# EAGLE design Dashboard (EAGLE 9.4.2)

## Sheet 1 of 7
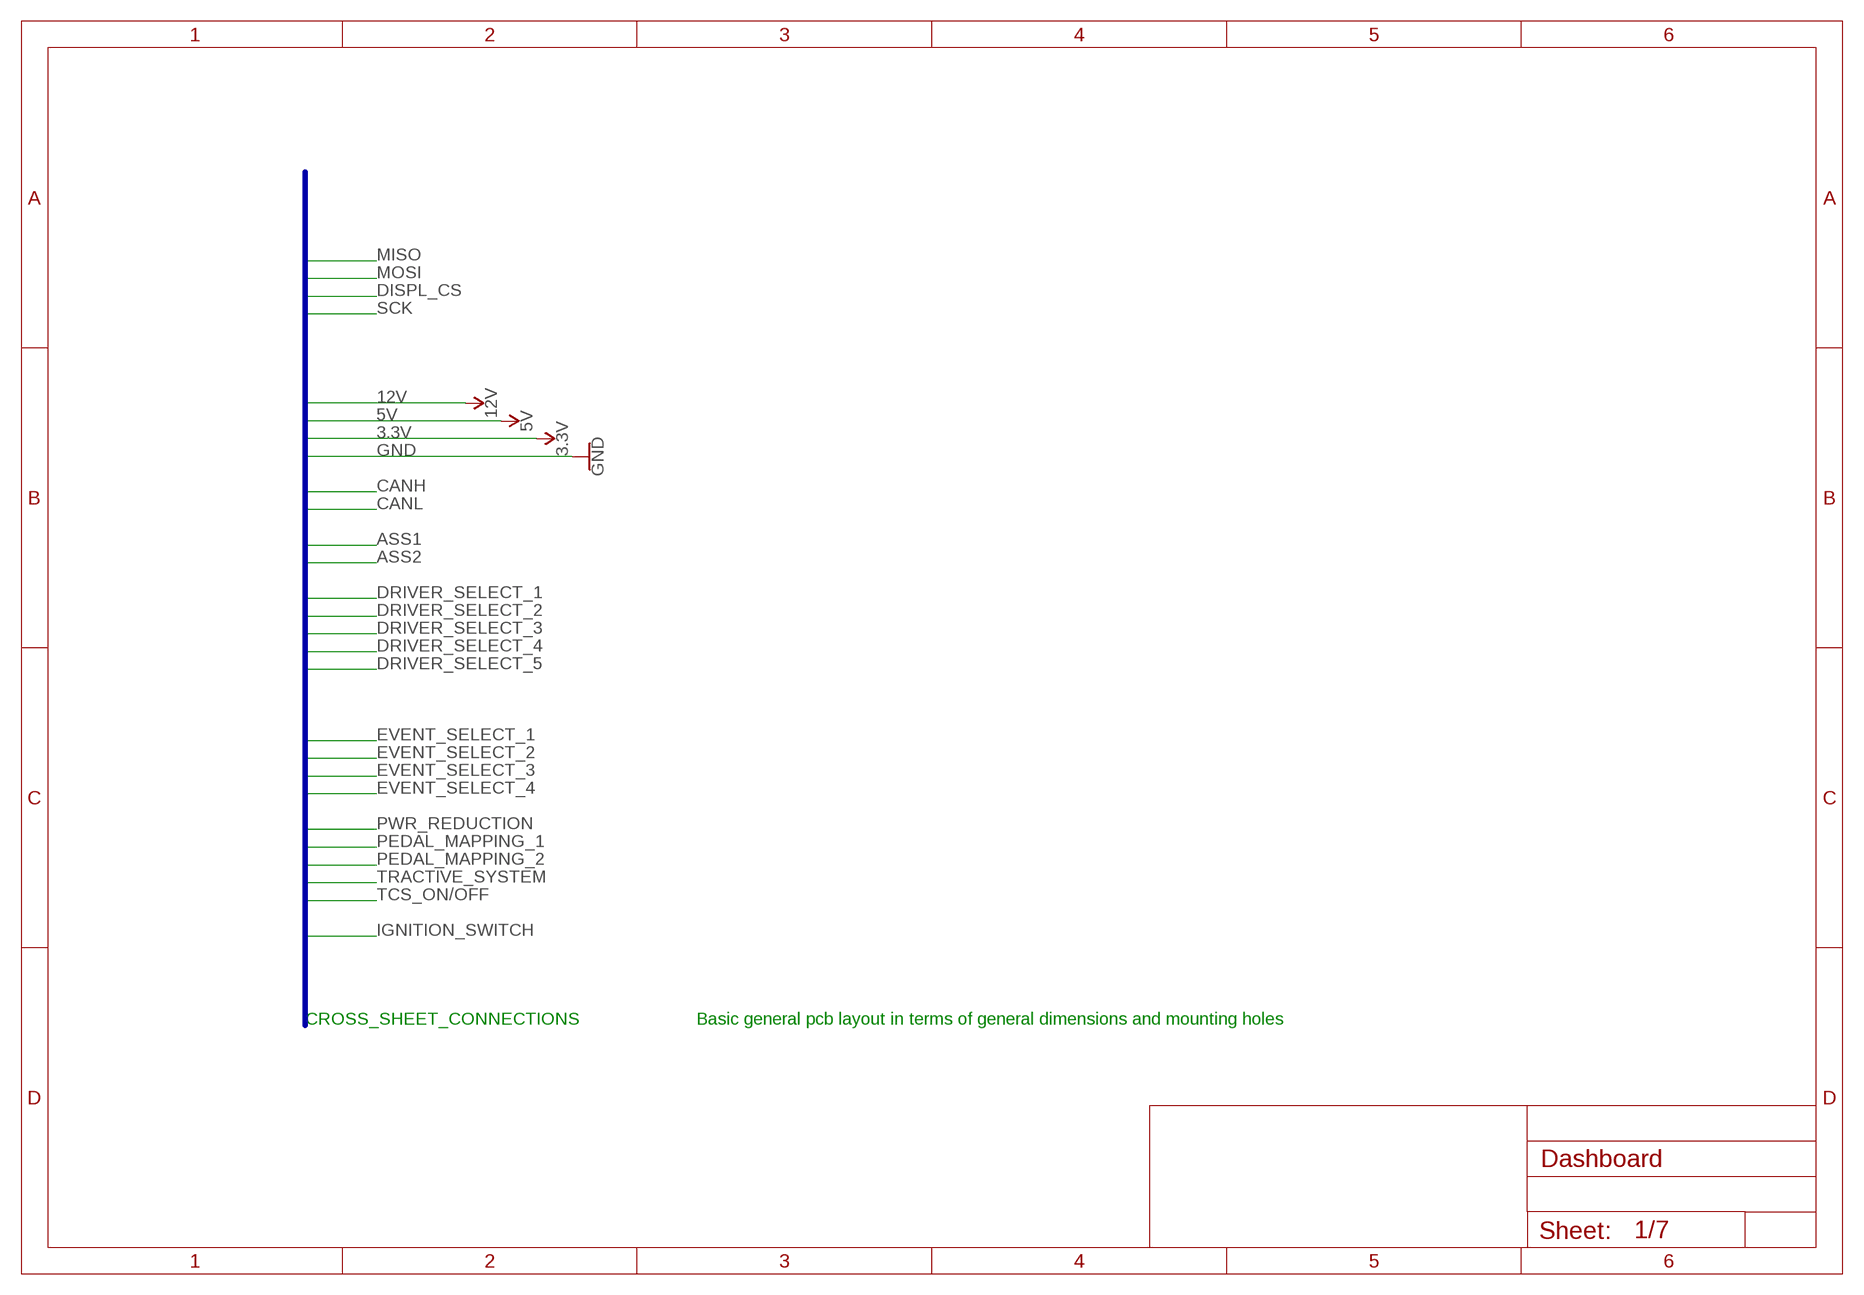
[diagram p0: schematic, sheet 1]

### Buses
3.3V,5V,12V,ASS1,ASS2,AUDIO_OUT,BRAKE_BIAS,CANH,CANL,DISPL_CS,DRIVER_SELECT,DRIVER_SELECT_1,DRIVER_SELECT_2,DRIVER_SELECT_3,DRIVER_SELECT_4,DRIVER_SELECT_5,EMERGENCY_STOP,EVENT_SELECT,EVENT_SELECT_1,EVENT_SELECT_2,EVENT_SELECT_3,EVENT_SELECT_4,GND,IGNITION_SWITCH,MISO,MOSI,MSIO,PEDAL_MAPPING,PEDAL_MAPPING_1,PEDAL_MAPPING_2,PWR_REDUCTION,SCK,TCS_ON/OFF,TSMS

### Notes on the sheet
- CROSS_SHEET_CONNECTIONS | Basic general pcb layout in terms of general dimensions and mounting holes

## Sheet 2 of 7: INPUTS
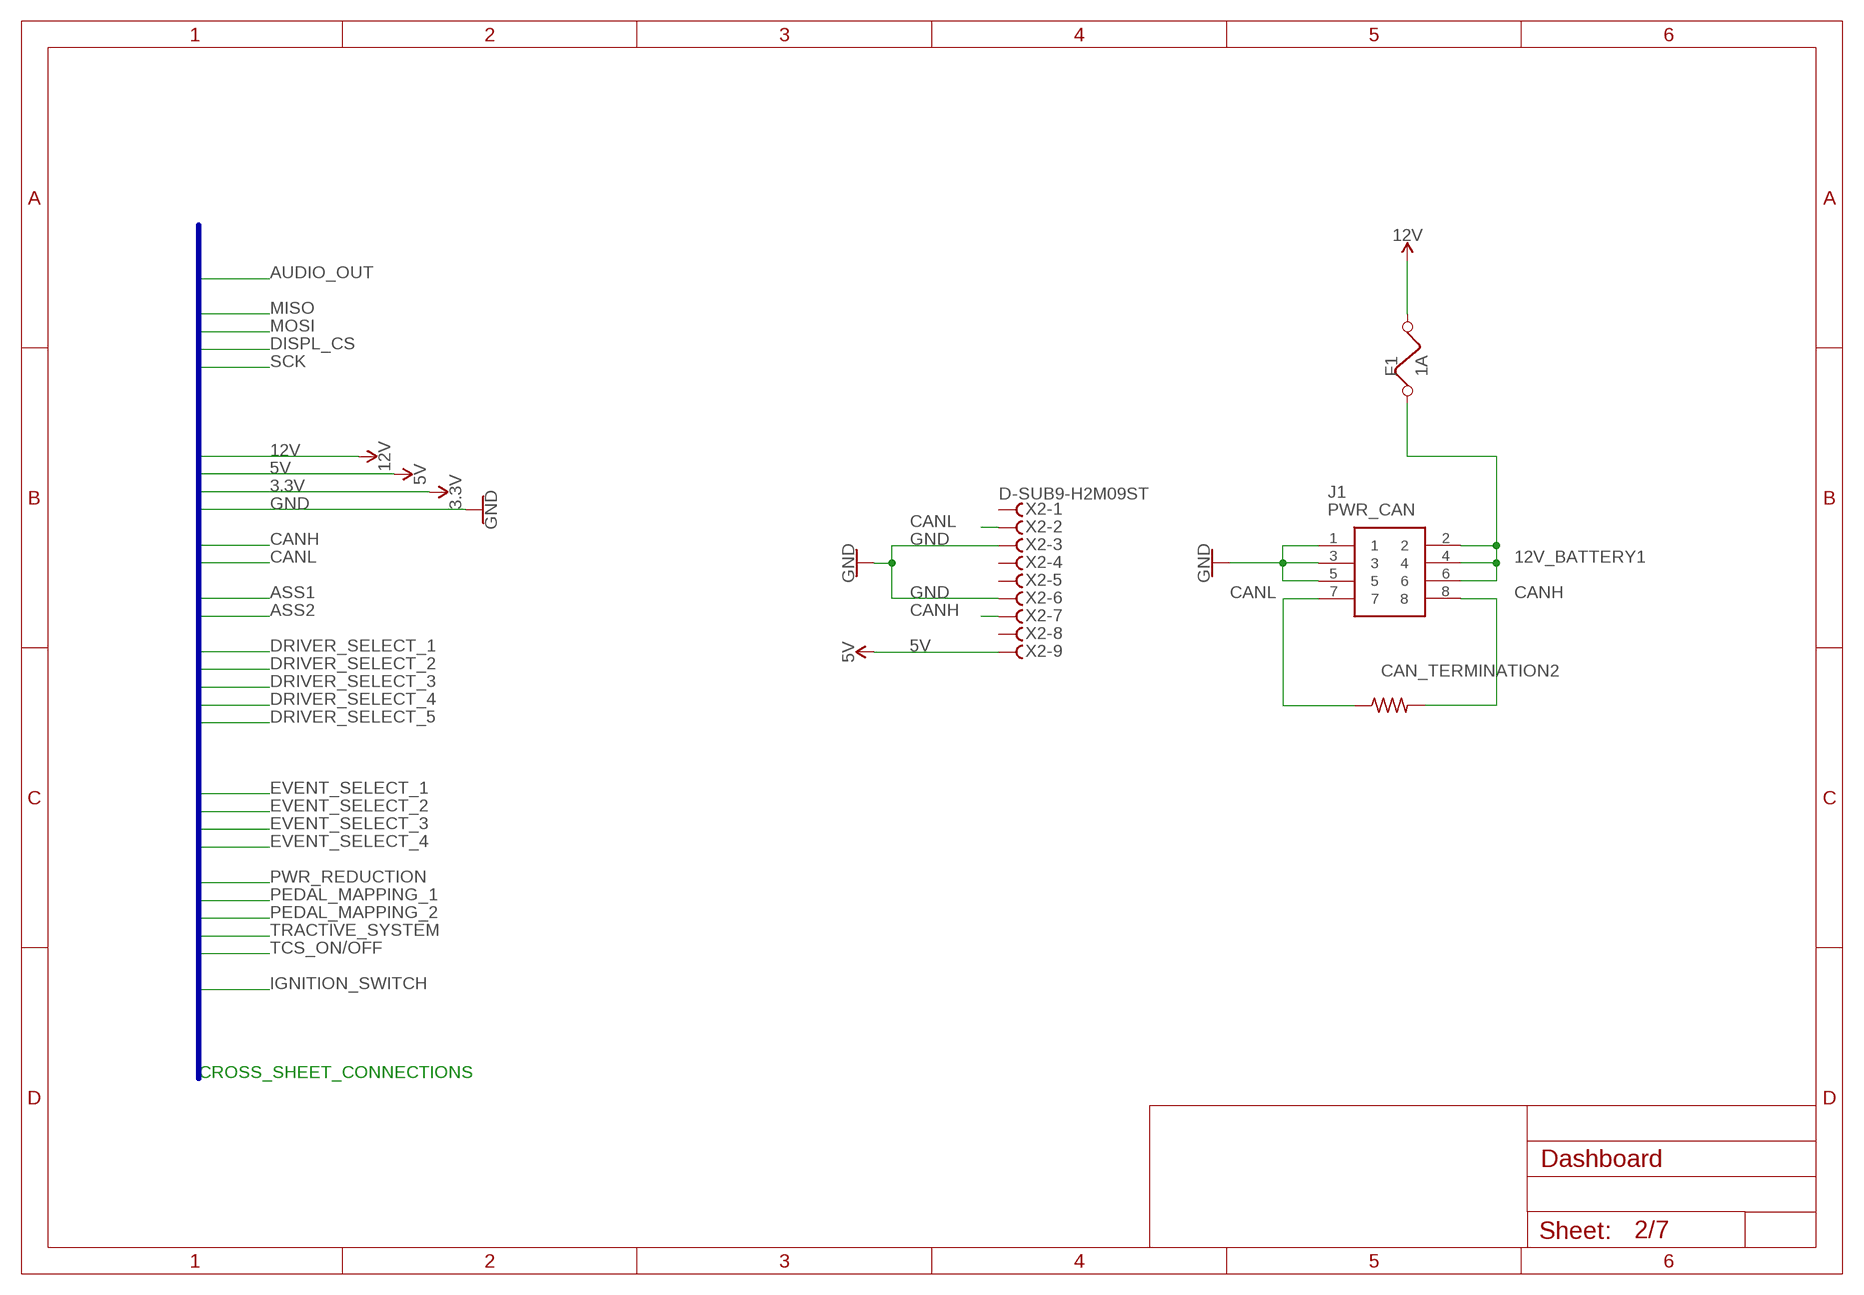
[diagram p1: schematic, sheet 2]

### Parts
CAN_TERMINATION2  120  R-US_R0805  [R0805]
F1  1A  FUSE  [FUSE]
J1  PWR_CAN  T821108A1S100CEU  [HDRV8W64P254_2X4_1778X895X915P]
X2  D-SUB9-H2M09ST  [H2M09ST]

### Nets
5V: X2.9 ; also sheet 1,3,4,5,6,7
12V: F1.2 ; also sheet 1,3,4,5,6,7
12V_BATTERY1: F1.1 J1.2 J1.4 J1.6
CANH: CAN_TERMINATION2.2 J1.8 X2.7 ; also sheet 1,3,4,5,6,7
CANL: CAN_TERMINATION2.1 J1.7 X2.2 ; also sheet 1,3,4,5,6,7
GND: J1.1 J1.3 J1.5 X2.3 X2.6 ; also sheet 1,3,4,5,6,7
Unconnected: X2.1 X2.4 X2.5 X2.8

### Buses
3.3V,5V,12V,ASS1,ASS2,BRAKE_BIAS,CANH,CANL,DISPL_CS,DRIVER_SELECT,DRIVER_SELECT_1,DRIVER_SELECT_2,DRIVER_SELECT_3,DRIVER_SELECT_4,DRIVER_SELECT_5,EMERGENCY_STOP,EVENT_SELECT,EVENT_SELECT_1,EVENT_SELECT_2,EVENT_SELECT_3,EVENT_SELECT_4,GND,IGNITION_SWITCH,MISO,MOSI,MSIO,PEDAL_MAPPING,PEDAL_MAPPING_1,PEDAL_MAPPING_2,PWR_REDUCTION,SCK,TCS_ON/OFF,TRACTIVE_SYSTEM,TSMS

### Notes on the sheet
- CROSS_SHEET_CONNECTIONS

## Sheet 3 of 7: POWER DELIVERY
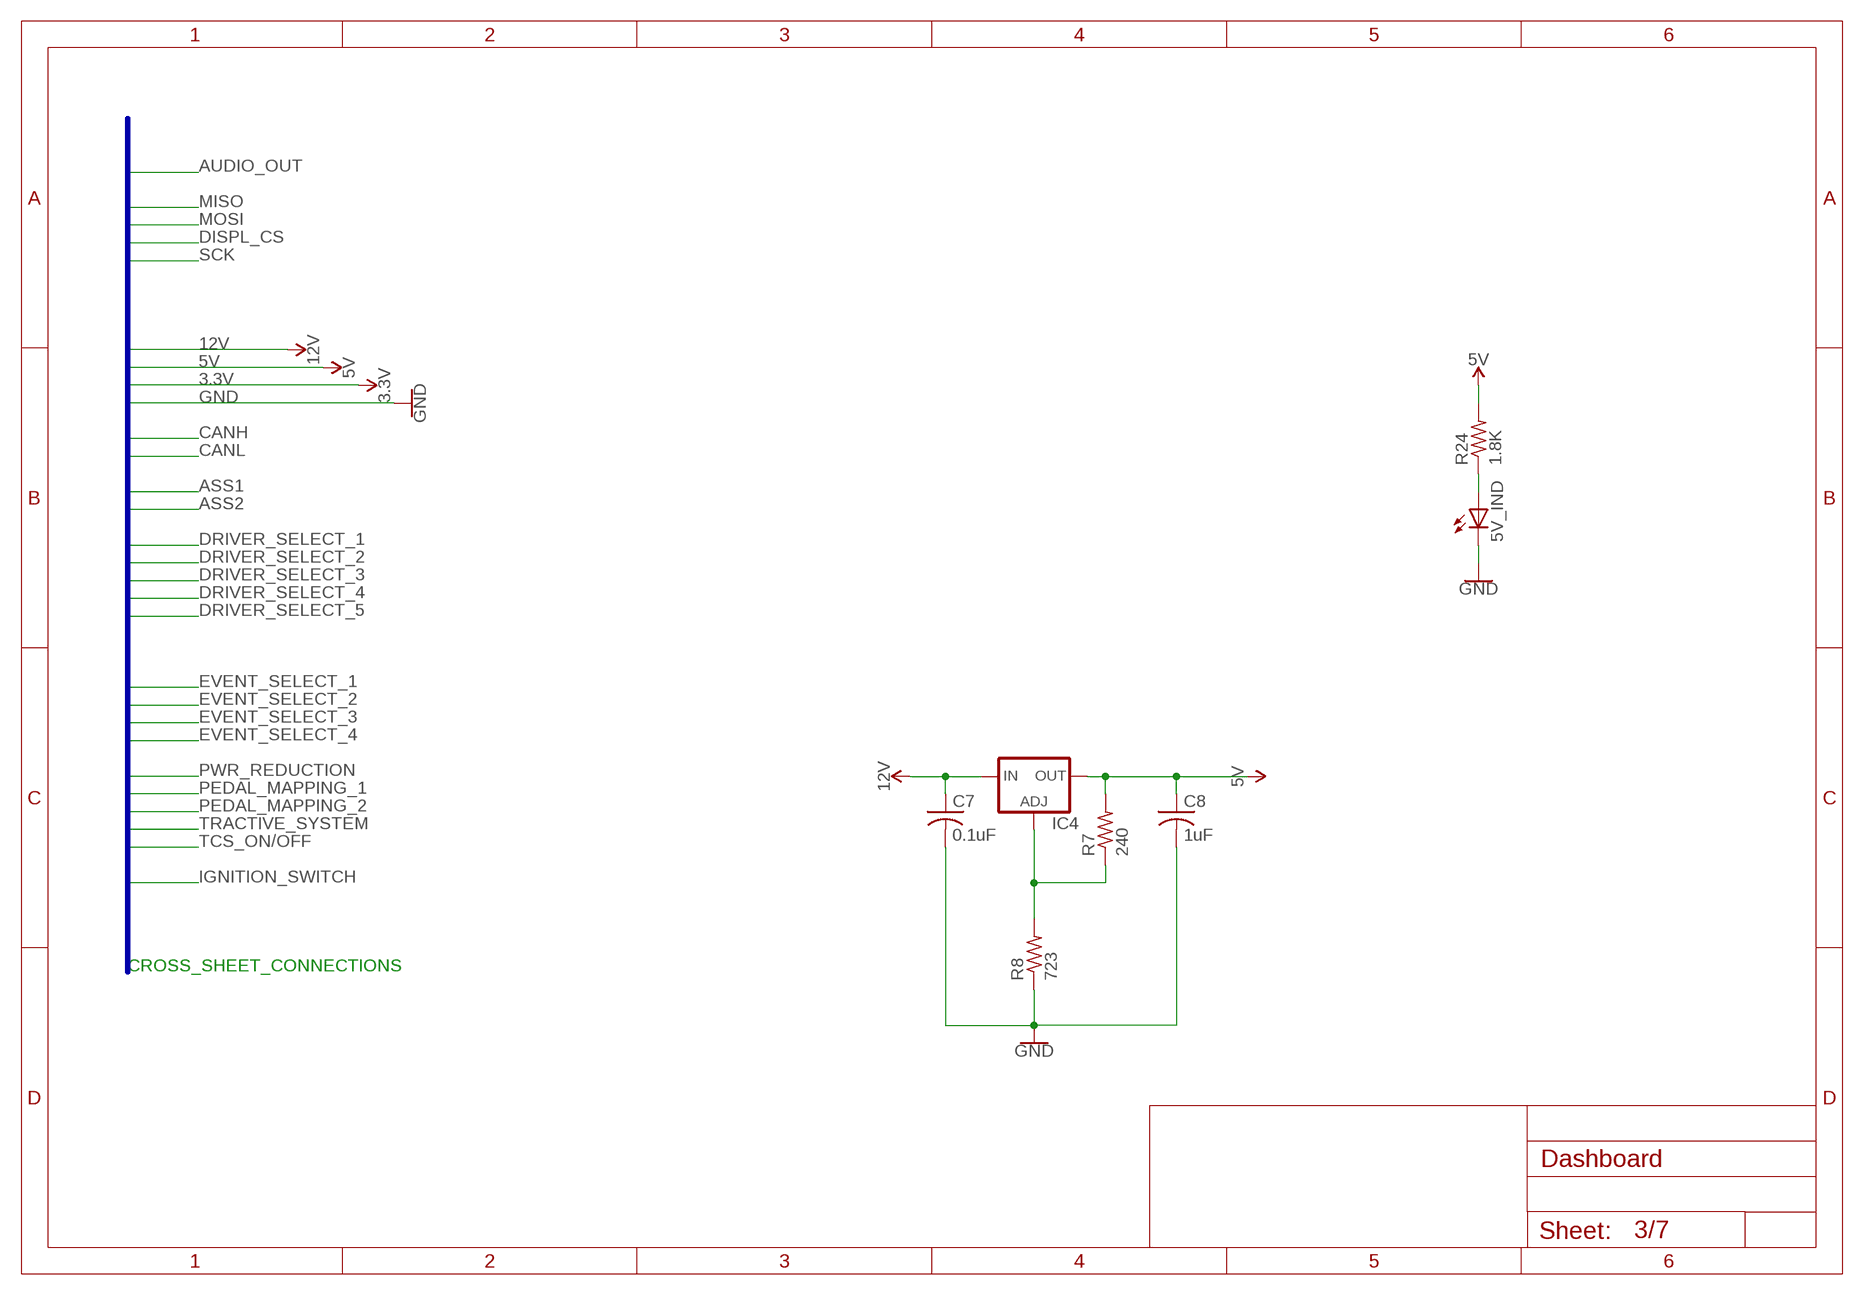
[diagram p2: schematic, sheet 3]

### Parts
5V_IND  LED3MM  [LED3MM]
C7  0.1uF  C-US050-025X075  [C050-025X075]
C8  1uF  C-US050-025X075  [C050-025X075]
IC4  LM317TS  [317TS]
R7  240  R-US_R0805  [R0805]
R8  723  R-US_R0805  [R0805]
R24  1.8K  R-US_R0805  [R0805]

### Nets
5V: C8.1 IC4.2(OUT) R7.2 R24.2 ; also sheet 1,2,4,5,6,7
12V: C7.1 IC4.3(IN) ; also sheet 1,2,4,5,6,7
GND: 5V_IND.K(C) C7.2 C8.2 R8.1 ; also sheet 1,2,4,5,6,7
N$1: 5V_IND.A R24.1
N$6: IC4.1(ADJ) R7.1 R8.2

### Buses
3.3V,5V,12V,ASS1,ASS2,BRAKE_BIAS,CANH,CANL,DISPL_CS,DRIVER_SELECT,DRIVER_SELECT_1,DRIVER_SELECT_2,DRIVER_SELECT_3,DRIVER_SELECT_4,DRIVER_SELECT_5,EMERGENCY_STOP,EVENT_SELECT,EVENT_SELECT_1,EVENT_SELECT_2,EVENT_SELECT_3,EVENT_SELECT_4,GND,IGNITION_SWITCH,MISO,MOSI,MSIO,PEDAL_MAPPING,PEDAL_MAPPING_1,PEDAL_MAPPING_2,PWR_REDUCTION,SCK,TCS_ON/OFF,TSMS

### Notes on the sheet
- CROSS_SHEET_CONNECTIONS

## Sheet 4 of 7: MICROCONTROLLER
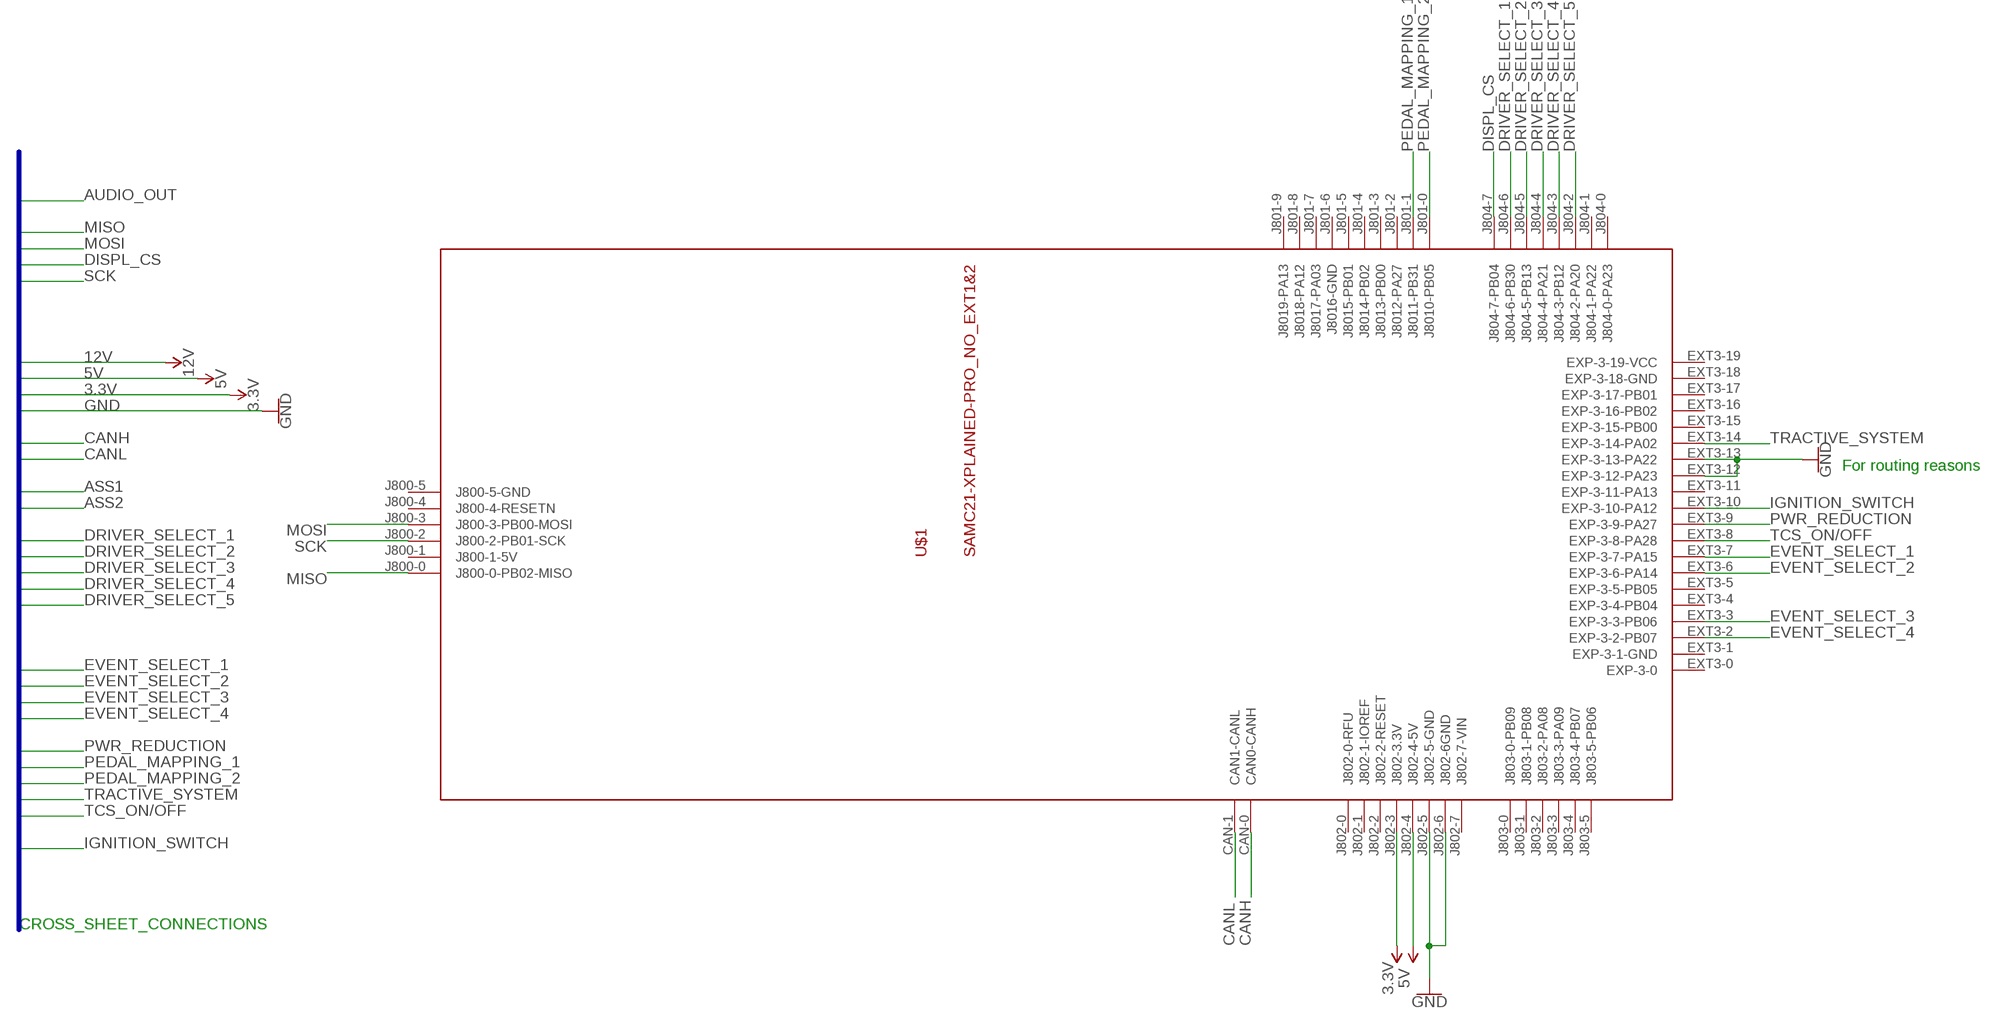
[diagram p3: schematic, sheet 4]

### Parts
U$1  SAMC21-XPLAINED-PRO_NO_EXT1&2  [SAMC21-XPLAINED-PRO_NO_EXT1&2]

### Nets
3.3V: U$1.J802-3(J802-3.3V) ; also sheet 1,2,3,5,6,7
5V: U$1.J802-4(J802-4-5V) ; also sheet 1,2,3,5,6,7
CANH: U$1.CAN-0(CAN0-CANH) ; also sheet 1,2,3,5,6,7
CANL: U$1.CAN-1(CAN1-CANL) ; also sheet 1,2,3,5,6,7
DISPL_CS: U$1.J804-7(J804-7-PB04) ; also sheet 1,2,3,5,6,7
DRIVER_SELECT_1: U$1.J804-6(J804-6-PB30) ; also sheet 1,2,3,5,6,7
DRIVER_SELECT_2: U$1.J804-5(J804-5-PB13) ; also sheet 1,2,3,5,6,7
DRIVER_SELECT_3: U$1.J804-4(J804-4-PA21) ; also sheet 1,2,3,5,6,7
DRIVER_SELECT_4: U$1.J804-3(J804-3-PB12) ; also sheet 1,2,3,5,6,7
DRIVER_SELECT_5: U$1.J804-2(J804-2-PA20) ; also sheet 1,2,3,5,6,7
EVENT_SELECT_1: U$1.EXT3-7(EXP-3-7-PA15) ; also sheet 1,2,3,5,6,7
EVENT_SELECT_2: U$1.EXT3-6(EXP-3-6-PA14) ; also sheet 1,2,3,5,6,7
EVENT_SELECT_3: U$1.EXT3-3(EXP-3-3-PB06) ; also sheet 1,2,3,5,6,7
EVENT_SELECT_4: U$1.EXT3-2(EXP-3-2-PB07) ; also sheet 1,2,3,5,6,7
GND: U$1.EXT3-12(EXP-3-12-PA23) U$1.EXT3-13(EXP-3-13-PA22) U$1.J802-5(J802-5-GND) U$1.J802-6(J802-6GND) ; also sheet 1,2,3,5,6,7
IGNITION_SWITCH: U$1.EXT3-10(EXP-3-10-PA12) ; also sheet 1,2,3,5,6,7
MISO: U$1.J800-0(J800-0-PB02-MISO) ; also sheet 1,2,3,5,6,7
MOSI: U$1.J800-3(J800-3-PB00-MOSI) ; also sheet 1,2,3,5,6,7
PEDAL_MAPPING_1: U$1.J801-1(J8011-PB31) ; also sheet 1,2,3,5,6,7
PEDAL_MAPPING_2: U$1.J801-0(J8010-PB05) ; also sheet 1,2,3,5,6,7
PWR_REDUCTION: U$1.EXT3-9(EXP-3-9-PA27) ; also sheet 1,2,3,5,6,7
SCK: U$1.J800-2(J800-2-PB01-SCK) ; also sheet 1,2,3,5,6,7
TCS_ON/OFF: U$1.EXT3-8(EXP-3-8-PA28) ; also sheet 1,2,3,5,6,7
TRACTIVE_SYSTEM: U$1.EXT3-14(EXP-3-14-PA02) ; also sheet 1,2,3,5,6,7
Unconnected: U$1.EXT3-0(EXP-3-0) U$1.EXT3-1(EXP-3-1-GND) U$1.EXT3-4(EXP-3-4-PB04) U$1.EXT3-5(EXP-3-5-PB05) U$1.EXT3-11(EXP-3-11-PA13) U$1.EXT3-15(EXP-3-15-PB00) U$1.EXT3-16(EXP-3-16-PB02) U$1.EXT3-17(EXP-3-17-PB01) U$1.EXT3-18(EXP-3-18-GND) U$1.EXT3-19(EXP-3-19-VCC) U$1.J800-1(J800-1-5V) U$1.J800-4(J800-4-RESETN) U$1.J800-5(J800-5-GND) U$1.J801-2(J8012-PA27) U$1.J801-3(J8013-PB00) U$1.J801-4(J8014-PB02) U$1.J801-5(J8015-PB01) U$1.J801-6(J8016-GND) U$1.J801-7(J8017-PA03) U$1.J801-8(J8018-PA12) U$1.J801-9(J8019-PA13) U$1.J802-0(J802-0-RFU) U$1.J802-1(J802-1-IOREF) U$1.J802-2(J802-2-RESET) U$1.J802-7(J802-7-VIN) U$1.J803-0(J803-0-PB09) U$1.J803-1(J803-1-PB08) U$1.J803-2(J803-2-PA08) U$1.J803-3(J803-3-PA09) U$1.J803-4(J803-4-PB07) U$1.J803-5(J803-5-PB06) U$1.J804-0(J804-0-PA23) U$1.J804-1(J804-1-PA22)

### Buses
3.3V,5V,12V,ASS1,ASS2,AUDIO_OUT,BRAKE_BIAS,CANH,CANL,DISPL_CS,DRIVER_SELECT,DRIVER_SELECT_1,DRIVER_SELECT_2,DRIVER_SELECT_3,DRIVER_SELECT_4,DRIVER_SELECT_5,EMERGENCY_STOP,EVENT_SELECT,EVENT_SELECT_1,EVENT_SELECT_2,EVENT_SELECT_3,EVENT_SELECT_4,GND,IGNITION_SWITCH,MISO,MOSI,MSIO,PEDAL_MAPPING,PEDAL_MAPPING_1,PEDAL_MAPPING_2,PWR_REDUCTION,SCK,TCS_ON/OFF,TRACTIVE_SYSTEM,TSMS

### Notes on the sheet
- For routing reasons
- CROSS_SHEET_CONNECTIONS

## Sheet 5 of 7: CAN OUTPUT
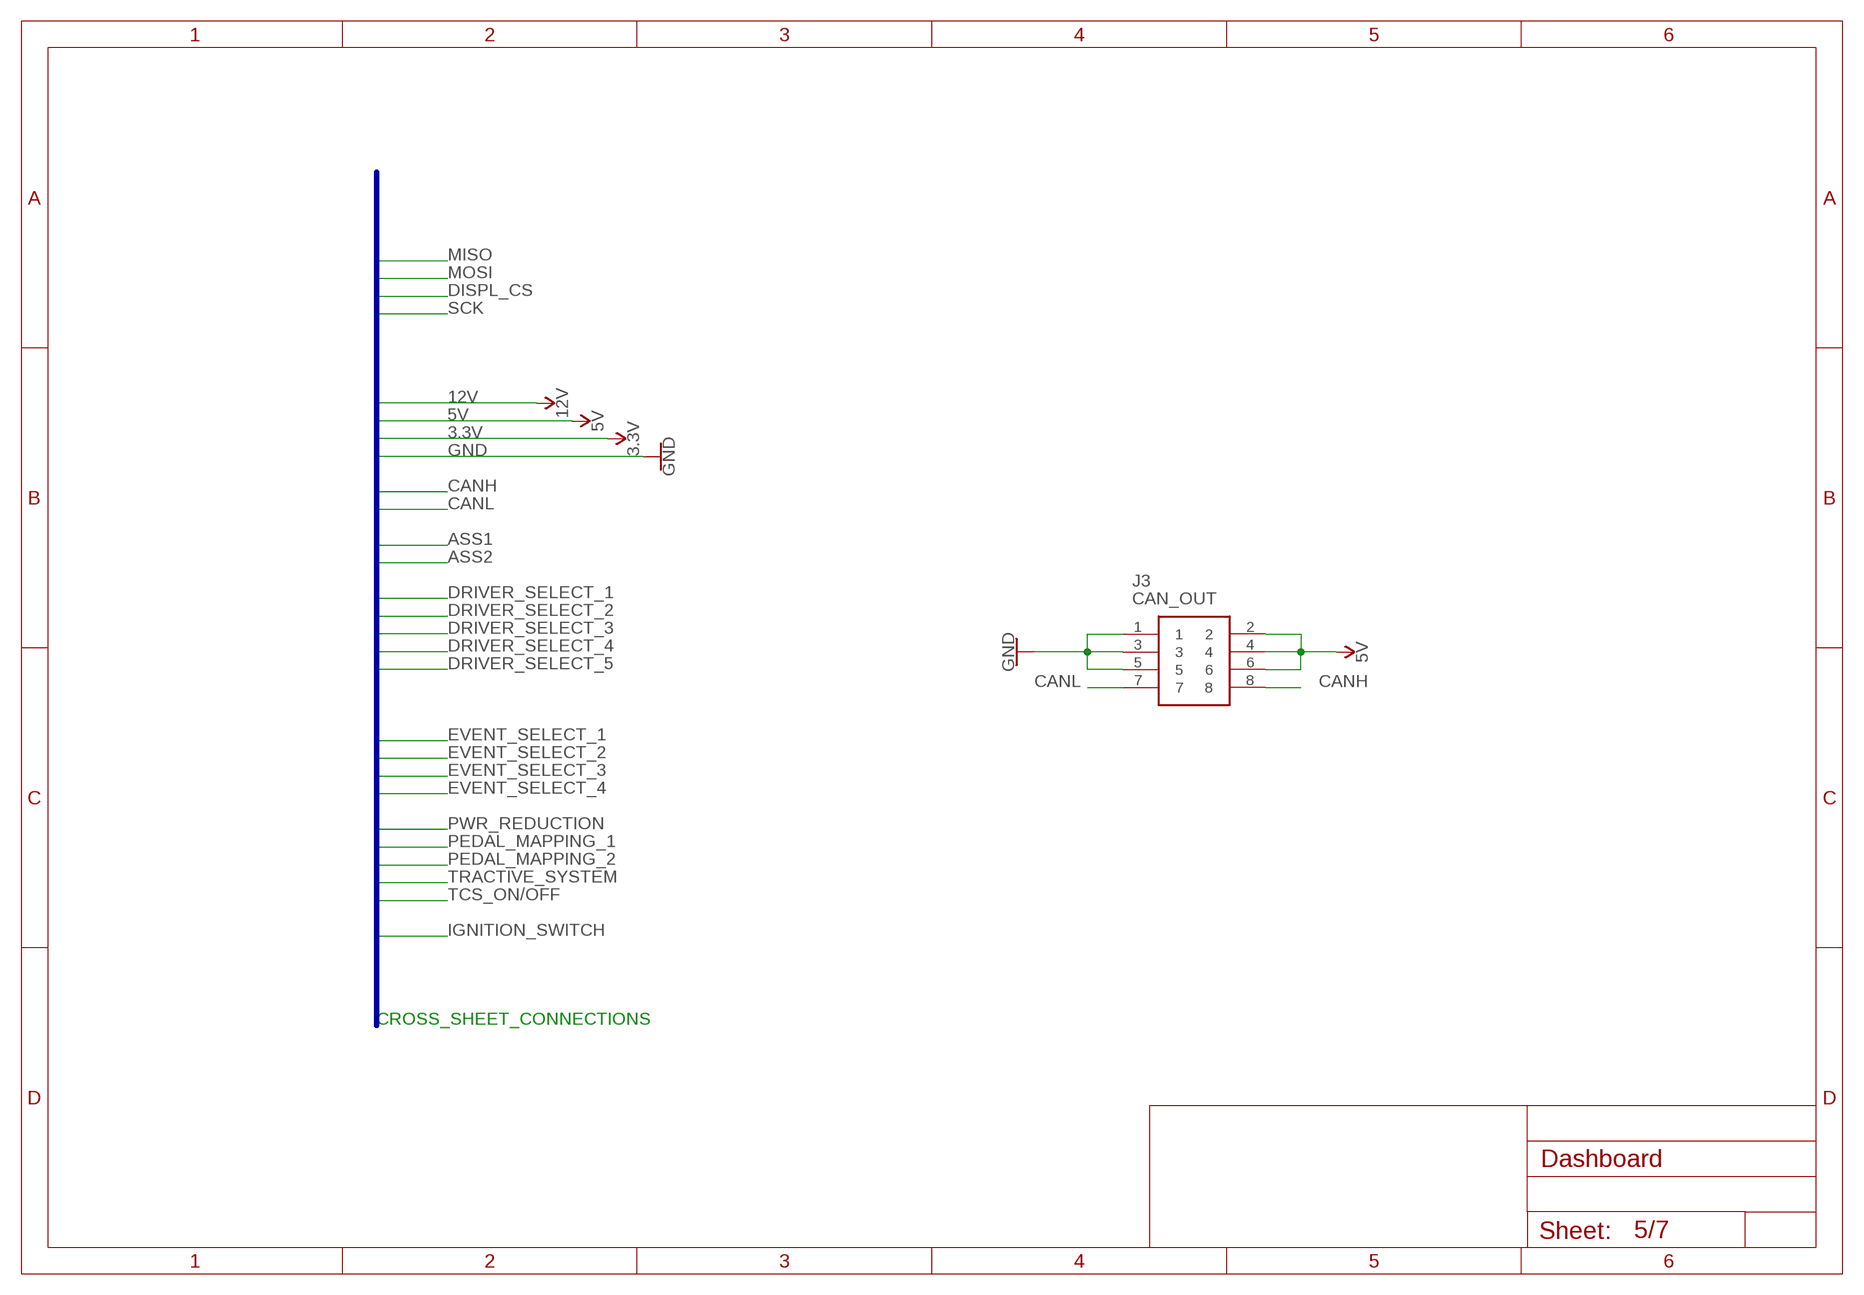
[diagram p4: schematic, sheet 5]

### Parts
J3  CAN_OUT  T821108A1S100CEU  [HDRV8W64P254_2X4_1778X895X915P]

### Nets
5V: J3.2 J3.4 J3.6 ; also sheet 1,2,3,4,6,7
CANH: J3.8 ; also sheet 1,2,3,4,6,7
CANL: J3.7 ; also sheet 1,2,3,4,6,7
GND: J3.1 J3.3 J3.5 ; also sheet 1,2,3,4,6,7

### Buses
3.3V,5V,12V,ASS1,ASS2,BRAKE_BIAS,CANH,CANL,DISPL_CS,DRIVER_SELECT,DRIVER_SELECT_1,DRIVER_SELECT_2,DRIVER_SELECT_3,DRIVER_SELECT_4,DRIVER_SELECT_5,EMERGENCY_STOP,EVENT_SELECT,EVENT_SELECT_1,EVENT_SELECT_2,EVENT_SELECT_3,EVENT_SELECT_4,GND,IGNITION_SWITCH,MISO,MOSI,MSIO,PEDAL_MAPPING,PEDAL_MAPPING_1,PEDAL_MAPPING_2,PWR_REDUCTION,SCK,TCS_ON/OFF,TSMS

### Notes on the sheet
- CROSS_SHEET_CONNECTIONS

## Sheet 6 of 7: DISPLAY MODULE
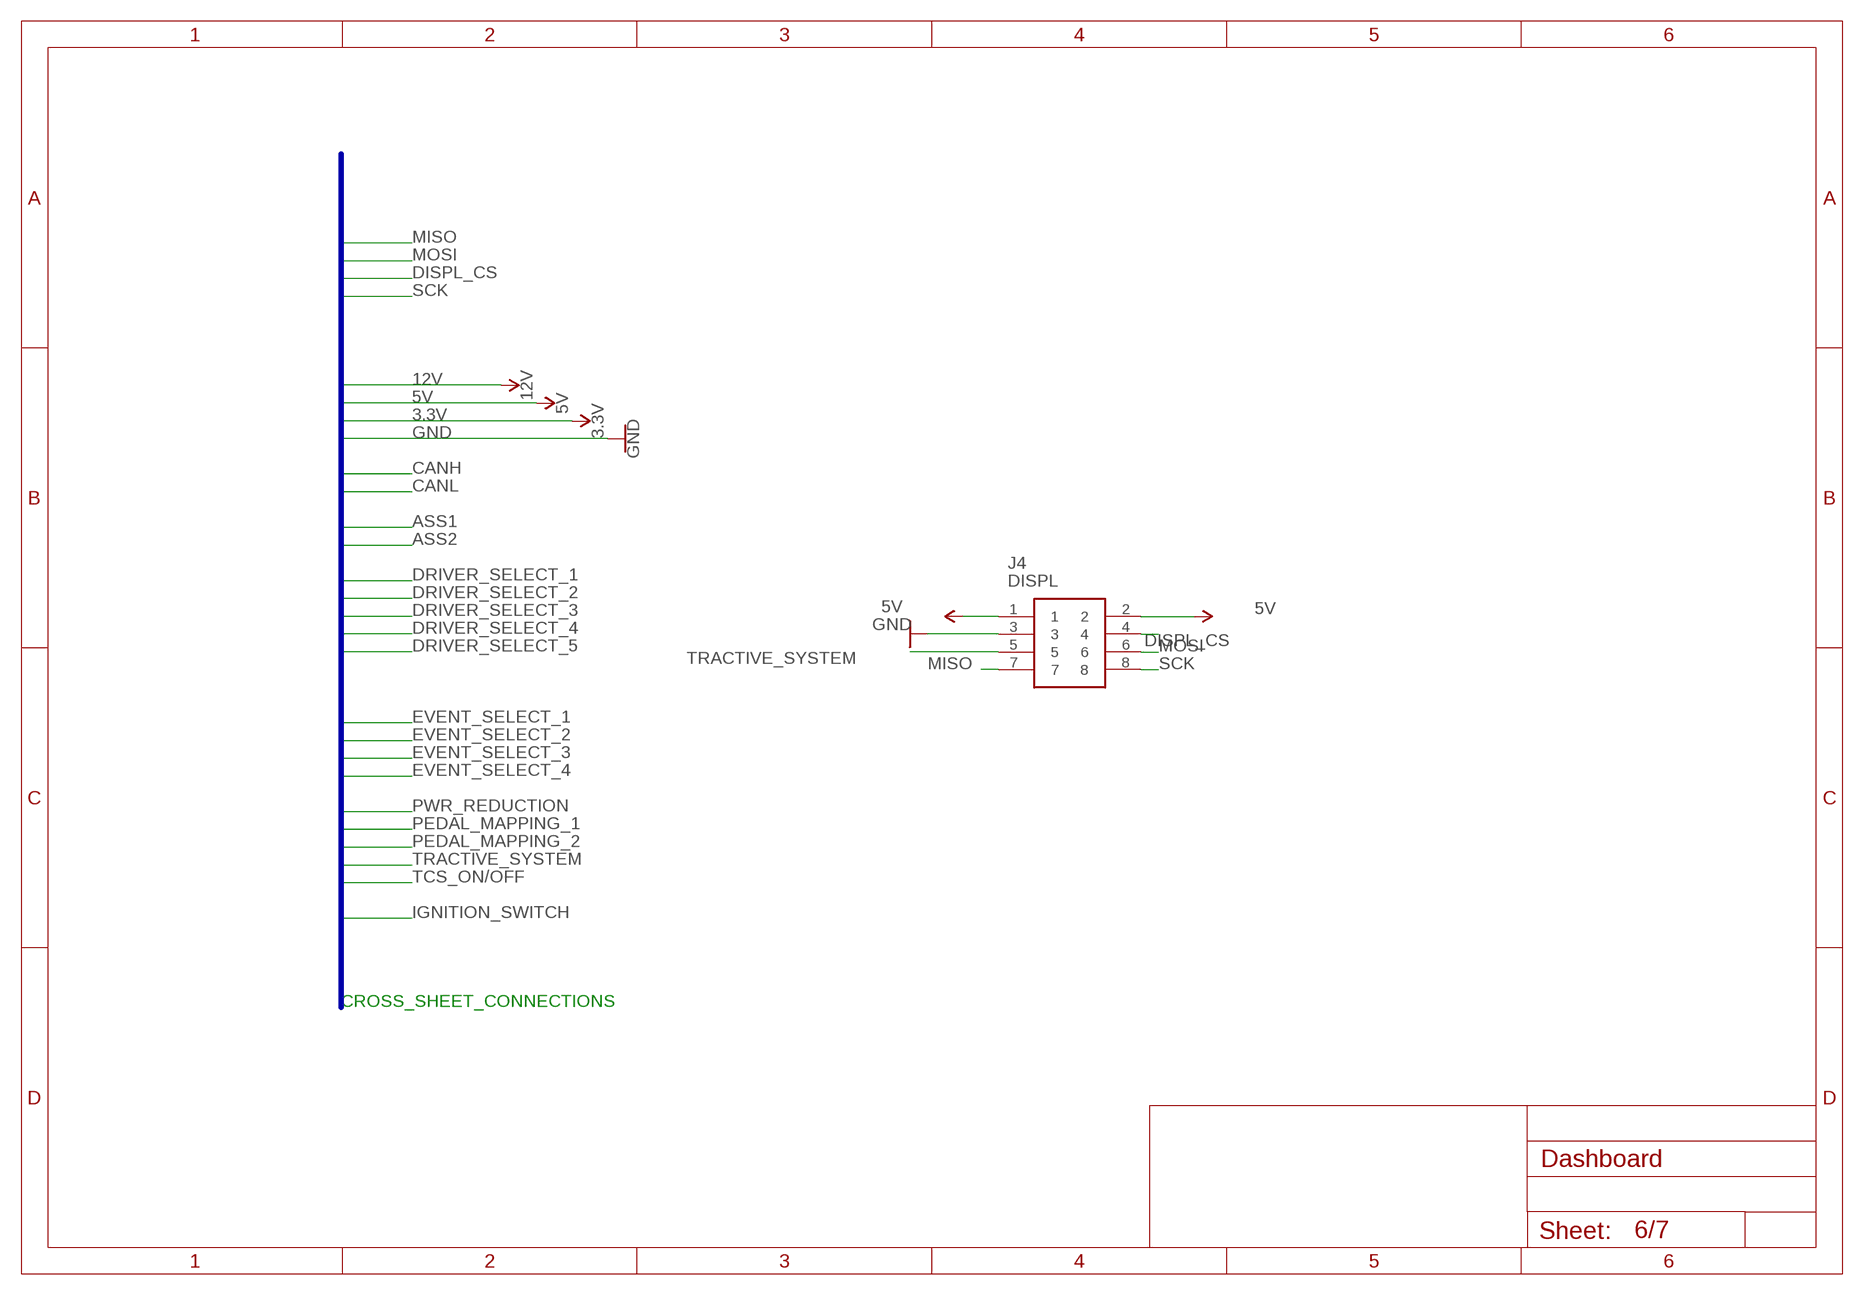
[diagram p5: schematic, sheet 6]

### Parts
J4  DISPL  T821108A1S100CEU  [HDRV8W64P254_2X4_1778X895X915P]

### Nets
5V: J4.1 J4.2 ; also sheet 1,2,3,4,5,7
DISPL_CS: J4.4 ; also sheet 1,2,3,4,5,7
GND: J4.3 ; also sheet 1,2,3,4,5,7
MISO: J4.7 ; also sheet 1,2,3,4,5,7
MOSI: J4.6 ; also sheet 1,2,3,4,5,7
SCK: J4.8 ; also sheet 1,2,3,4,5,7
TRACTIVE_SYSTEM: J4.5 ; also sheet 1,2,3,4,5,7

### Buses
3.3V,5V,12V,ASS1,ASS2,AUDIO_OUT,BRAKE_BIAS,CANH,CANL,DISPL_CS,DRIVER_SELECT,DRIVER_SELECT_1,DRIVER_SELECT_2,DRIVER_SELECT_3,DRIVER_SELECT_4,DRIVER_SELECT_5,EMERGENCY_STOP,EVENT_SELECT,EVENT_SELECT_1,EVENT_SELECT_2,EVENT_SELECT_3,EVENT_SELECT_4,GND,IGNITION_SWITCH,MISO,MOSI,MSIO,PEDAL_MAPPING,PEDAL_MAPPING_1,PEDAL_MAPPING_2,PWR_REDUCTION,SCK,TCS_ON/OFF,TRACTIVE_SYSTEM,TSMS

### Notes on the sheet
- CROSS_SHEET_CONNECTIONS

## Sheet 7 of 7: BUTTONS
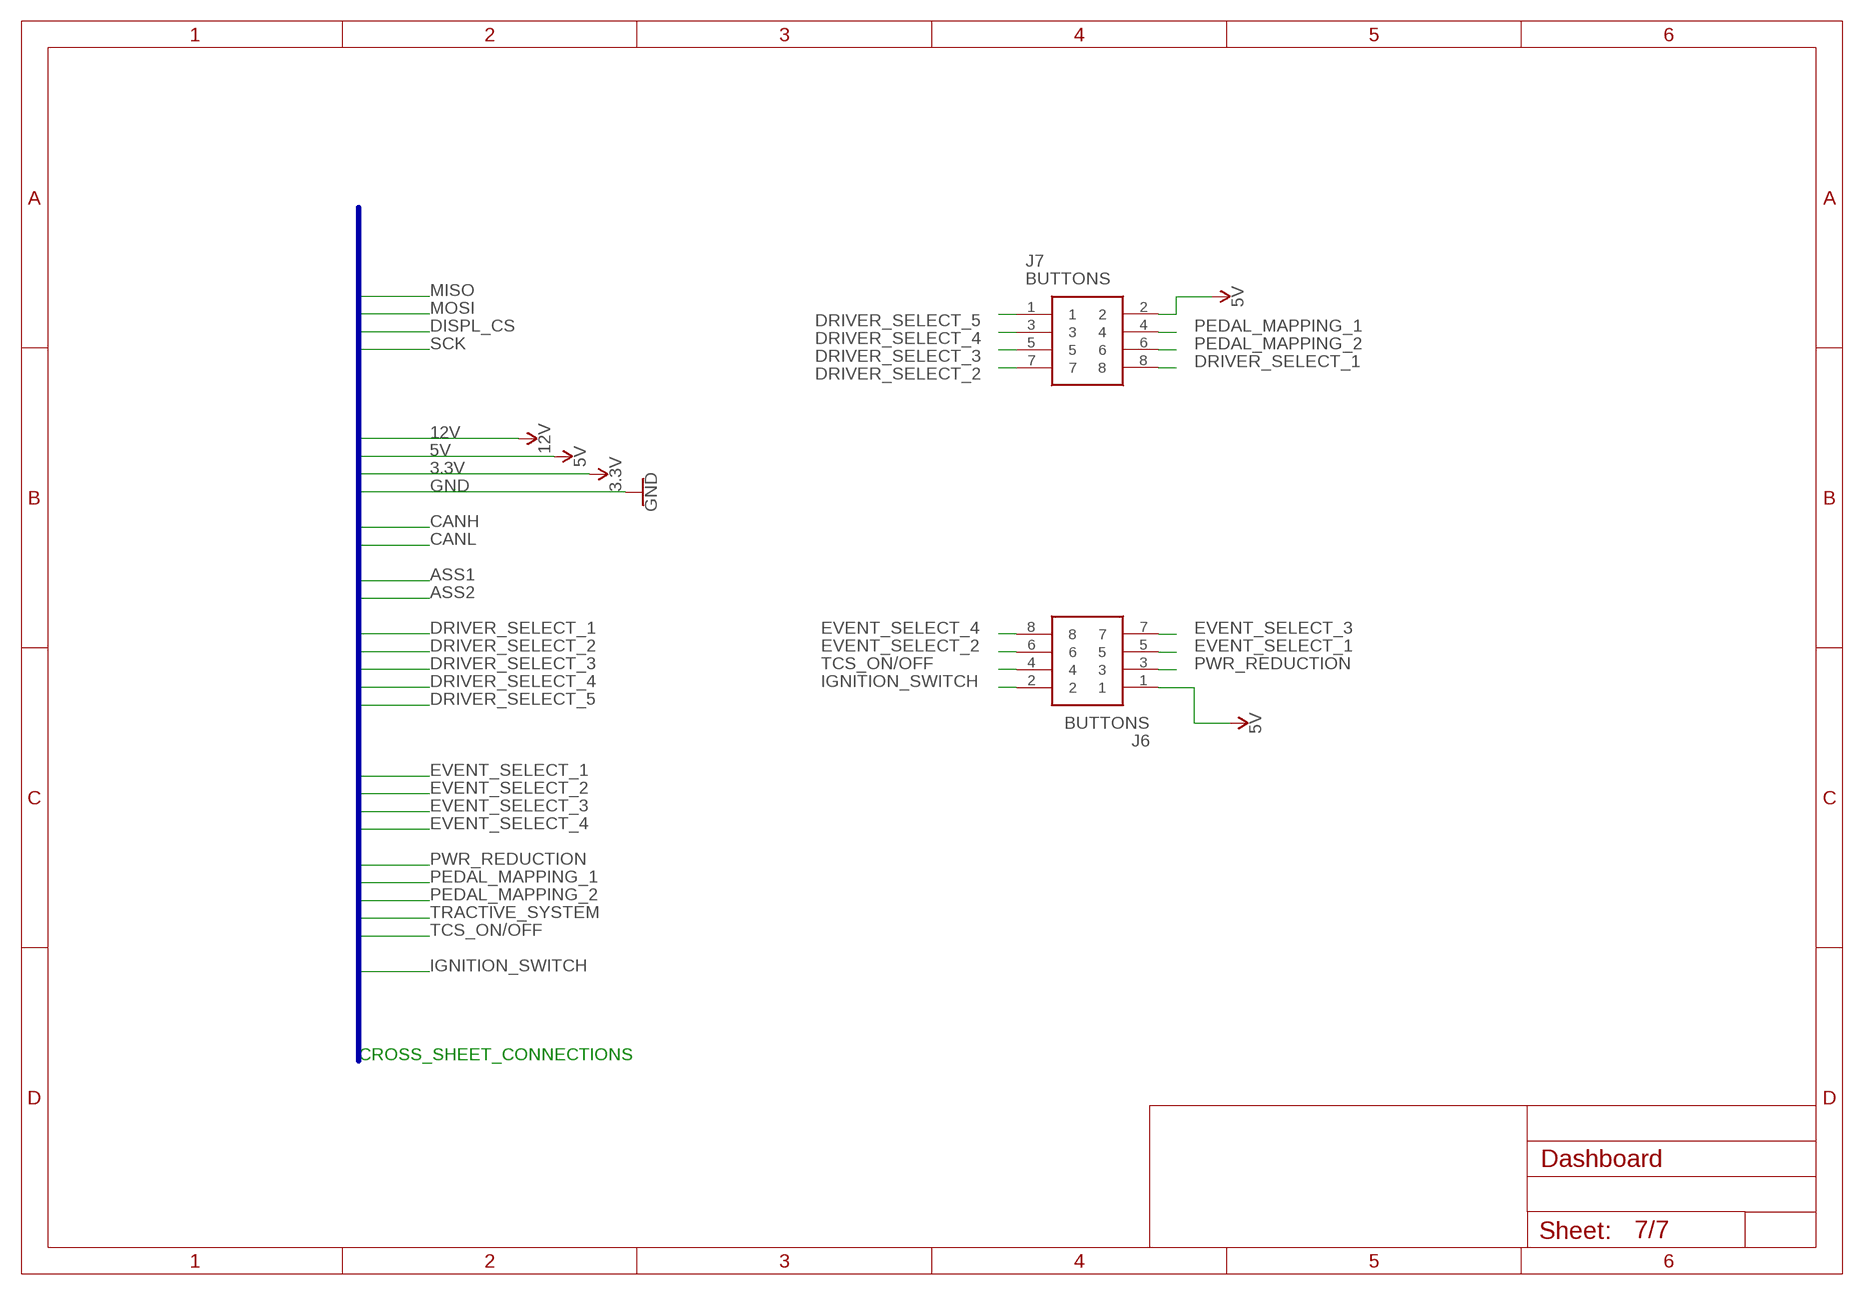
[diagram p6: schematic, sheet 7]

### Parts
J6  BUTTONS  T821108A1S100CEU  [HDRV8W64P254_2X4_1778X895X915P]
J7  BUTTONS  T821108A1S100CEU  [HDRV8W64P254_2X4_1778X895X915P]

### Nets
5V: J6.1 J7.2 ; also sheet 1,2,3,4,5,6
DRIVER_SELECT_1: J7.8 ; also sheet 1,2,3,4,5,6
DRIVER_SELECT_2: J7.7 ; also sheet 1,2,3,4,5,6
DRIVER_SELECT_3: J7.5 ; also sheet 1,2,3,4,5,6
DRIVER_SELECT_4: J7.3 ; also sheet 1,2,3,4,5,6
DRIVER_SELECT_5: J7.1 ; also sheet 1,2,3,4,5,6
EVENT_SELECT_1: J6.5 ; also sheet 1,2,3,4,5,6
EVENT_SELECT_2: J6.6 ; also sheet 1,2,3,4,5,6
EVENT_SELECT_3: J6.7 ; also sheet 1,2,3,4,5,6
EVENT_SELECT_4: J6.8 ; also sheet 1,2,3,4,5,6
IGNITION_SWITCH: J6.2 ; also sheet 1,2,3,4,5,6
PEDAL_MAPPING_1: J7.4 ; also sheet 1,2,3,4,5,6
PEDAL_MAPPING_2: J7.6 ; also sheet 1,2,3,4,5,6
PWR_REDUCTION: J6.3 ; also sheet 1,2,3,4,5,6
TCS_ON/OFF: J6.4 ; also sheet 1,2,3,4,5,6

### Buses
3.3V,5V,12V,ASS1,ASS2,BRAKE_BIAS,CANH,CANL,DISPL_CS,DRIVER_SELECT,DRIVER_SELECT_1,DRIVER_SELECT_2,DRIVER_SELECT_3,DRIVER_SELECT_4,DRIVER_SELECT_5,EMERGENCY_STOP,EVENT_SELECT,EVENT_SELECT_1,EVENT_SELECT_2,EVENT_SELECT_3,EVENT_SELECT_4,GND,IGNITION_SWITCH,MISO,MOSI,MSIO,PEDAL_MAPPING,PEDAL_MAPPING_1,PEDAL_MAPPING_2,PWR_REDUCTION,SCK,TCS_ON/OFF,TSMS

### Notes on the sheet
- CROSS_SHEET_CONNECTIONS

## Library data of the parts
5V_IND = adafruit:LED: LED OSRAM: - CHIPLED LG R971, LG N971, LY N971, LG Q971, LY Q971, LO R971, LY R971 LH N974, LH R974 LS Q976, LO Q976, LY Q976 LO Q996 - Hyper CHIPLED LW Q18S LB Q993, LB Q99A, LB R99A - SideLED LS A670, LO A670, LY A670, LG A670, LP A670 LB A673, LV A673, LT A673, LW A673 LH A674 LY A675 LS A676, LA A676, LO A676, LY A676, LW A676 LS A679, LY A679, LG A679 - Hyper Micro SIDELED® LS Y876, LA Y876, LO Y876, LY Y876 LT Y87S - SmartLED LW L88C, LW L88S LB L89C, LB L89S, LG L890 LS L89K, LO L89K, LY L89K LS L896, LA L896, LO L896, LY L896 - TOPLED LS T670, LO T670, LY T670, LG T670, LP T670 LSG T670, LSP T670, LSY T670, LOP T670, LYG T670 LG T671, LOG T671, LSG T671 LB T673, LV T673, LT T673, LW T673 LH T674 LS T676, LA T676, LO T676, LY T676, LB T676, LH T676, LSB T676, LW T676 LB T67C, LV T67C, LT T67C, LS T67K, LO T67K, LY T67K, LW E67C LS E67B, LA E67B, LO E67B, LY E67B, LB E67C, LV E67C, LT E67C LW T67C LS T679, LY T679, LG T679 LS T770, LO T770, LY T770, LG T770, LP T770 LB T773, LV T773, LT T773, LW T773 LH T774 LS E675, LA E675, LY E675, LS T675 LS T776, LA T776, LO T776, LY T776, LB T776 LHGB T686 LT T68C, LB T68C - Hyper Mini TOPLED® LB M676 - Mini TOPLED Santana® LG M470 LS M47K, LO M47K, LY M47K Source: http://www.osram.convergy.de/
C7 C8 = adafruit:C-US: CAPACITOR, American symbol
CAN_TERMINATION2 R7 R8 R24 = adafruit:R-US_: RESISTOR, American symbol
F1 = special:FUSE: FUSE 5 x 20 mm
IC4 = v-reg:LM317TS: VOLTAGE REGULATOR
J1 J3 J4 J6 J7 = T821108A1S100CEU:T821108A1S100CEU: HEADER, VERTICAL, 2.54MM, 8WAY Amphenol T821 Series, 2.54mm Pitch 8 Way 2 Row Straight PCB Header, Solder Termination, 3A Source: Datasheet <http://uk.rs-online.com/web/p/products/1702738>; DESCRIPTION: HEADER, VERTICAL, 2.54MM, 8WAY Amphenol T821 Series, 2.54mm Pitch 8 Way 2 Row Straight PCB Header, Solder Termination, 3A; HEIGHT: 9.15mm; MANUFACTURER_NAME: Amphenol; MANUFACTURER_PART_NUMBER: T821108A1S100CEU; RS_PART_NUMBER: 1702738
U$1 = Oxford Uni Racing Custom Blueprints:SAMC21-XPLAINED-PRO_NO_EXT1&2
X2 = con-thomas-betts:D-SUB9-: D-Subminiatur Connector Source: Electronioc Interconnects European Edition 1998; OC_FARNELL: unknown; OC_NEWARK: unknown

## Board
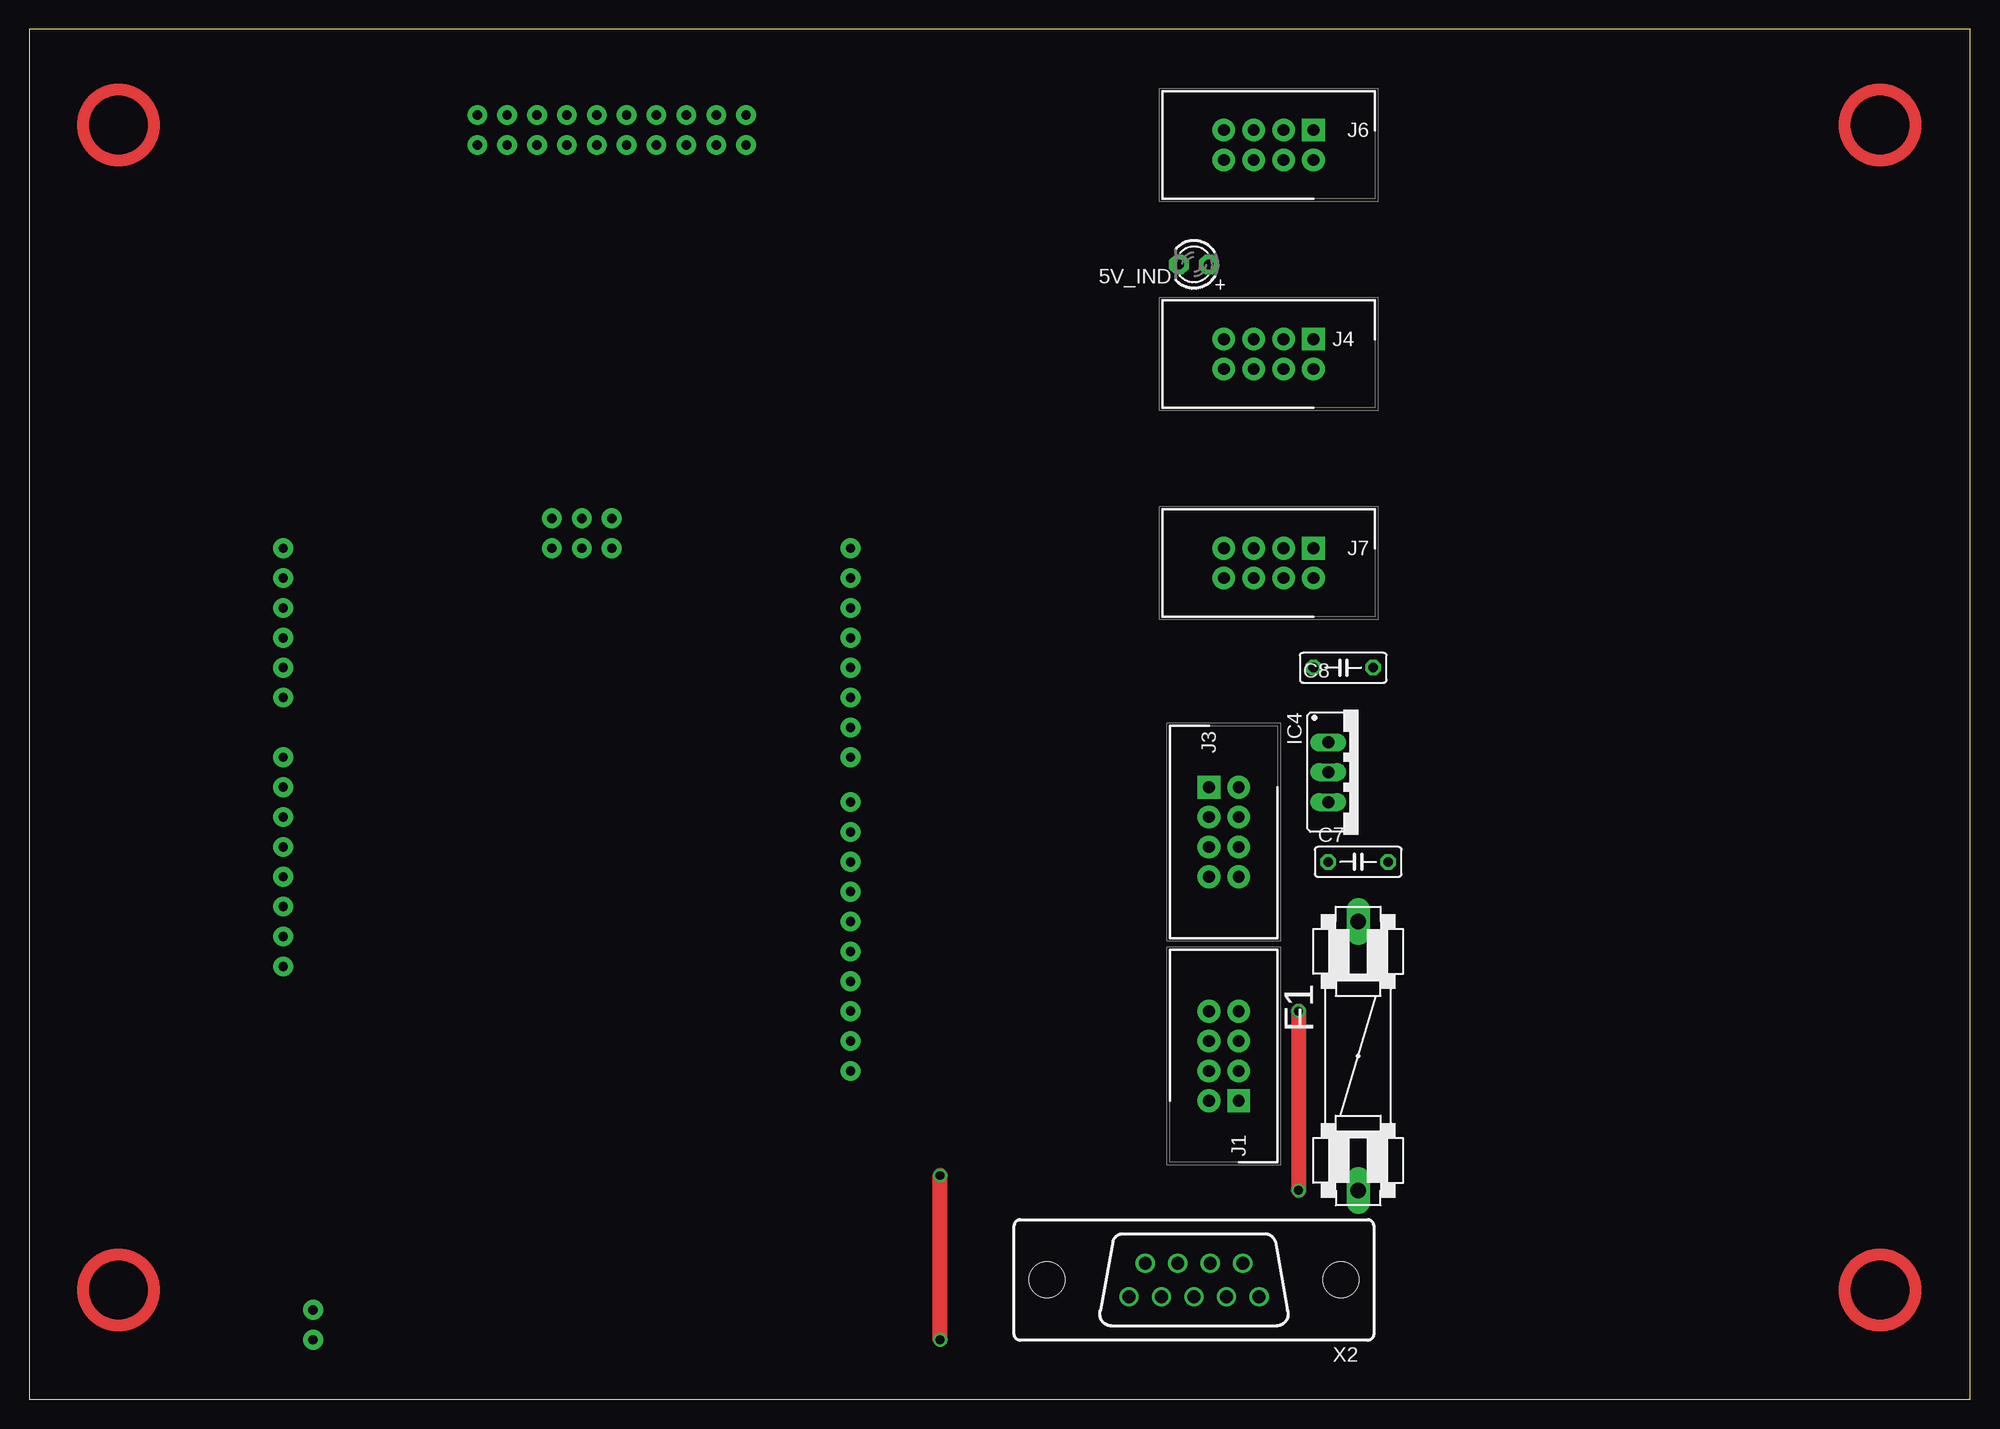
[diagram p7: board, top side]
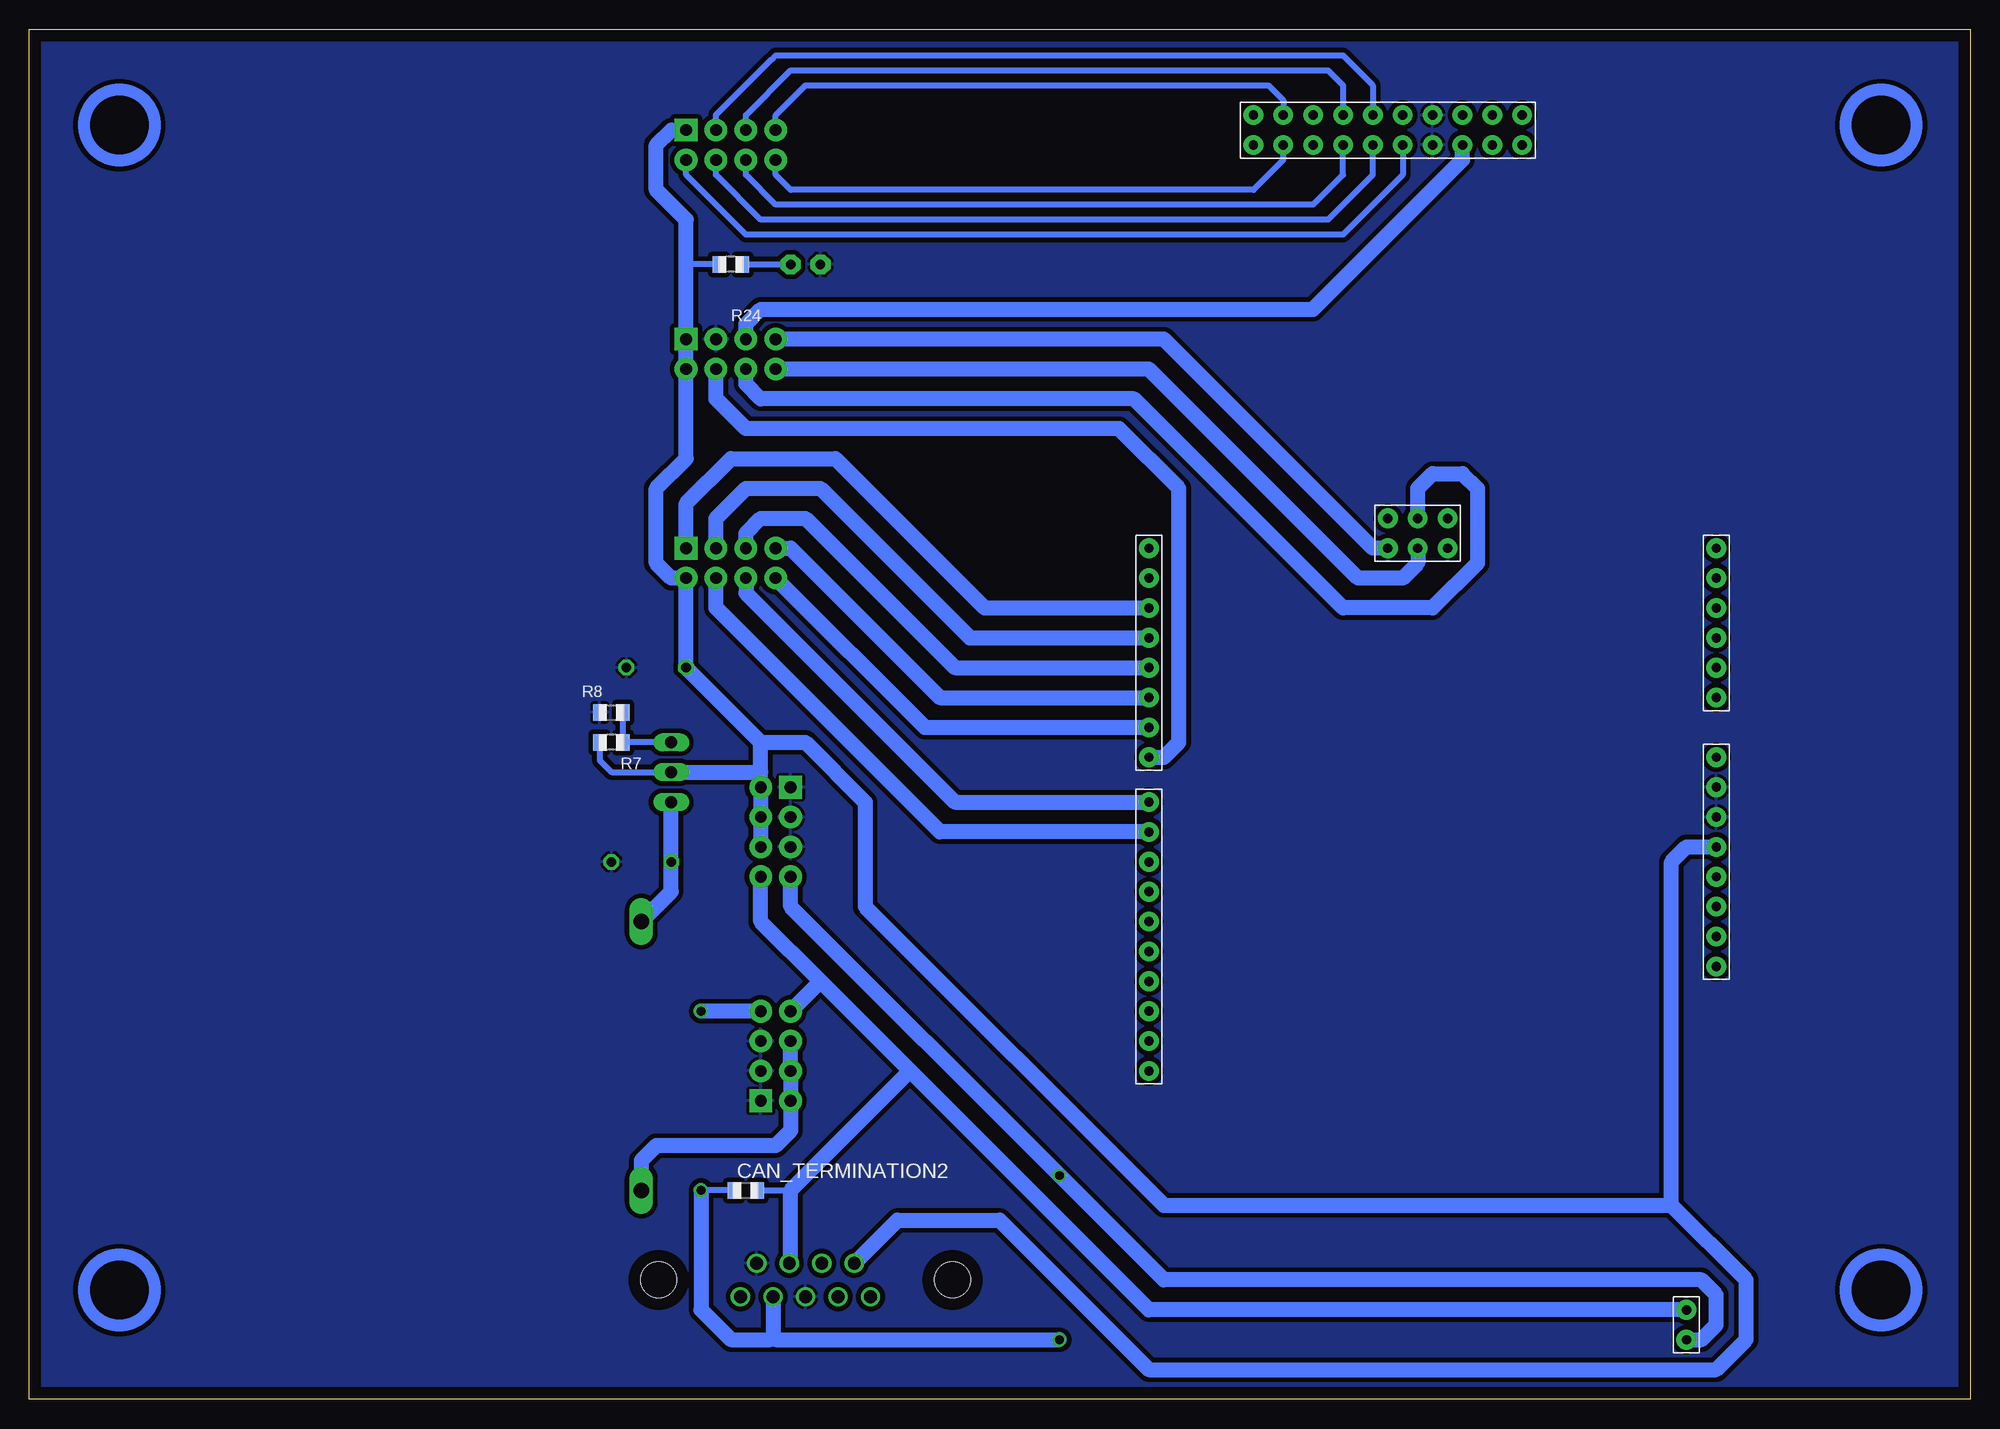
[diagram p8: board, bottom side, seen from below]

Size 165.08 x 116.51 mm. Coordinates in mm from the lower left corner, seen from the top.
Outline: 0,0 165.08,0 165.08,116.51 0,116.51 0,0
Copper layers (1*16): Top 0.035mm / dielectric 1.5mm / Bottom 0.035mm
Design rules "default *": minimum track width 6mil, minimum drill 0.35mm, track to track 16mil, track to pad 16mil, pad to pad 16mil, via to via 16mil, smd to smd 16mil, copper to edge 40mil, drill to drill 6mil, minimum pad ring 10mil, minimum via ring 8mil, stop-mask expansion 4mil, vias tented up to drill 0mil, thermal gap 10mil

### Footprints (pad centres in the part's own frame; a part is rotated, then mirrored left to right if it is on the bottom)
LED3MM = drill 0.813 pad 1.676 octagon: A -1.27,0; K 1.27,0
C050-025X075 = drill 0.813 octagon: 1 -2.54,0; 2 2.54,0
R0805 = smd 1.1 x 1.4: 1 -1,0; 2 1,0
FUSE = drill 1.321 long: 1 -11.43,0; 2 11.43,0
317TS = drill 1.016 long: 1 -2.54,-2.54; 2 0,-2.54; 3 2.54,-2.54
HDRV8W64P254_2X4_1778X895X915P = drill 1 pad 1.93 square: 1 0,0 | drill 1 pad 1.93: 2 0,2.54; 3 2.54,0; 4 2.54,2.54; 5 5.08,0; 6 5.08,2.54; 7 7.62,0; 8 7.62,2.54
SAMC21-XPLAINED-PRO_NO_EXT1&2 = drill 0.8 pad 1.676: CAN-0 2.54,64.77; CAN-1 2.54,67.31; EXT3-0 39.37,-34.29; EXT3-1 39.37,-36.83; EXT3-2 36.83,-34.29; EXT3-3 36.83,-36.83; EXT3-4 34.29,-34.29; EXT3-5 34.29,-36.83; EXT3-6 31.75,-34.29; EXT3-7 31.75,-36.83; EXT3-8 29.21,-34.29; EXT3-9 29.21,-36.83; EXT3-10 26.67,-34.29; EXT3-11 26.67,-36.83; EXT3-12 24.13,-34.29; EXT3-13 24.13,-36.83; EXT3-14 21.59,-34.29; EXT3-15 21.59,-36.83; EXT3-16 19.05,-34.29; EXT3-17 19.05,-36.83; EXT3-18 16.51,-34.29; EXT3-19 16.51,-36.83; J800-0 27.94,0; J800-1 27.94,-2.54; J800-2 25.4,0; J800-3 25.4,-2.54; J800-4 22.86,0; J800-5 22.86,-2.54; J801-0 48.26,21.59; J801-1 48.26,24.13; J801-2 48.26,26.67; J801-3 48.26,29.21; J801-4 48.26,31.75; J801-5 48.26,34.29; J801-6 48.26,36.83; J801-7 48.26,39.37; J801-8 48.26,41.91; J801-9 48.26,44.45; J802-0 0,35.56; J802-1 0,33.02; J802-2 0,30.48; J802-3 0,27.94; J802-4 0,25.4; J802-5 0,22.86; J802-6 0,20.32; J802-7 0,17.78; J803-0 0,12.7; J803-1 0,10.16; J803-2 0,7.62; J803-3 0,5.08; J803-4 0,2.54; J803-5 0,0; J804-0 48.26,0; J804-1 48.26,2.54; J804-2 48.26,5.08; J804-3 48.26,7.62; J804-4 48.26,10.16; J804-5 48.26,12.7; J804-6 48.26,15.24; J804-7 48.26,17.78
H2M09ST = drill 1.092: 1 -5.537,1.422; 2 -2.769,1.422; 3 0,1.422; 4 2.769,1.422; 5 5.537,1.422; 6 -4.153,-1.422; 7 -1.384,-1.422; 8 1.384,-1.422; 9 4.153,-1.422 | hole 3.048: -12.497,0; 12.497,0

### Placement (x,y rotation side)
5V_IND  99.06,96.52 180 top
C7  113.03,45.72 0 top
C8  111.76,62.23 0 top
CAN_TERMINATION2  104.14,17.78 0 bottom
F1  113.03,29.21 90 top
IC4  113.03,53.34 270 top
J1  102.87,25.4 90 top
J3  100.33,52.07 270 top
J4  109.22,90.17 180 top
J6  109.22,107.95 180 top
J7  109.22,72.39 180 top
R7  115.57,55.88 180 bottom
R8  115.57,58.42 0 bottom
R24  105.41,96.52 180 bottom
U$1  21.59,72.39 180 bottom
X2  99.06,10.16 180 top

### Tracks (layer width: path | path; a pad name or v marks a point on that pad's centre or on a via)
5V
  Bottom 0.508: R7.2 116.57,54.34 115.57,53.34 IC4.2 | R24.2 109.22,96.52
  Bottom 1.27: J6.1 110.49,107.95 111.76,106.68 111.76,102.87 109.22,100.33 109.22,96.52 J4.1 J4.2 109.22,80.01 111.76,77.47 111.76,71.12 110.49,69.85 J7.2 C8.1 102.87,55.88 | J3.6 J3.4 J3.2 102.87,53.34 | 102.87,53.34 102.87,55.88 | 102.87,55.88 99.06,55.88 93.98,50.8 93.98,41.91 68.58,16.51 25.4,16.51 | IC4.2 102.87,53.34 | X2.9 91.25,15.24 82.55,15.24 69.85,2.54 21.59,2.54 19.05,5.08 19.05,10.16 25.4,16.51 | U$1.J802-4 24.13,46.99 25.4,45.72 25.4,16.51
12V
  Bottom 1.27: F1.2 110.49,43.18 C7.1 IC4.3
12V_BATTERY1
  Bottom 1.27: F1.1 113.03,20.32 111.76,21.59 101.6,21.59 100.33,22.86 J1.2 J1.4 J1.6
CANH
  Bottom 0.508: CAN_TERMINATION2.2 100.33,17.78
  Bottom 1.27: U$1.CAN-0 69.85,7.62 90.17,27.94 | J3.8 102.87,40.64 97.79,35.56 | X2.7 100.33,11.7 100.33,17.78 90.17,27.94 | 90.17,27.94 97.79,35.56 | J1.8 97.79,35.56
CANL  (via drill 0.75)
  Top 1.27: v77.47,5.08 v77.47,19.05 | v107.95,33.02 v107.95,17.78
  Bottom 0.508: CAN_TERMINATION2.1 v107.95,17.78
  Bottom 1.27: U$1.CAN-1 22.86,5.08 21.59,6.35 21.59,8.89 22.86,10.16 68.58,10.16 v77.47,19.05 100.33,41.91 J3.7 | X2.2 101.83,5.31 | 101.83,5.31 101.6,5.08 v77.47,5.08 | J1.7 v107.95,33.02 | v107.95,17.78 107.95,7.62 105.41,5.08 102.06,5.08 101.83,5.31
DISPL_CS
  Bottom 1.27: U$1.J804-7 68.58,54.61 67.31,55.88 67.31,77.47 72.39,82.55 104.14,82.55 106.68,85.09 J4.4
DRIVER_SELECT_1
  Bottom 1.27: J7.8 88.9,57.15 U$1.J804-6
DRIVER_SELECT_2
  Bottom 1.27: J7.7 100.33,72.39 87.63,59.69 U$1.J804-5
DRIVER_SELECT_3
  Bottom 1.27: J7.5 104.14,73.66 102.87,74.93 99.06,74.93 86.36,62.23 U$1.J804-4
DRIVER_SELECT_4
  Bottom 1.27: J7.3 106.68,74.93 104.14,77.47 97.79,77.47 85.09,64.77 U$1.J804-3
DRIVER_SELECT_5
  Bottom 1.27: J7.1 109.22,76.2 105.41,80.01 96.52,80.01 83.82,67.31 U$1.J804-2
EVENT_SELECT_1
  Bottom 0.508: U$1.EXT3-7 53.34,111.76 54.61,113.03 100.33,113.03 104.14,109.22 J6.5
EVENT_SELECT_2
  Bottom 0.508: U$1.EXT3-6 53.34,104.14 55.88,101.6 101.6,101.6 104.14,104.14 J6.6
EVENT_SELECT_3
  Bottom 0.508: U$1.EXT3-3 58.42,110.49 59.69,111.76 99.06,111.76 101.6,109.22 J6.7
EVENT_SELECT_4
  Bottom 0.508: U$1.EXT3-2 58.42,105.41 60.96,102.87 100.33,102.87 101.6,104.14 J6.8
GND
  pour Bottom (isolate 0.406): 0,116.84 0,0 165.1,0 165.1,116.84
IGNITION_SWITCH
  Bottom 0.508: U$1.EXT3-10 48.26,104.14 53.34,99.06 104.14,99.06 109.22,104.14 J6.2
MISO
  Bottom 1.27: U$1.J800-0 50.8,72.39 68.58,90.17 J4.7
MOSI
  Bottom 1.27: U$1.J800-3 46.99,77.47 45.72,78.74 43.18,78.74 41.91,77.47 41.91,71.12 45.72,67.31 53.34,67.31 71.12,85.09 102.87,85.09 104.14,86.36 J4.6
N$1
  Bottom 0.508: R24.1 5V_IND.A
N$6
  Bottom 0.508: IC4.1 R7.1 R8.2
PEDAL_MAPPING_1
  Bottom 1.27: U$1.J801-1 87.63,48.26 106.68,67.31 J7.4
PEDAL_MAPPING_2
  Bottom 1.27: J7.6 104.14,68.58 86.36,50.8 U$1.J801-0
PWR_REDUCTION
  Bottom 0.508: U$1.EXT3-9 50.8,111.76 53.34,114.3 101.6,114.3 101.96,113.94 101.98,113.94 106.68,109.24 J6.3
SCK
  Bottom 1.27: U$1.J800-2 46.99,71.12 48.26,69.85 52.07,69.85 69.85,87.63 J4.8
TCS_ON/OFF
  Bottom 0.508: U$1.EXT3-8 50.8,104.14 54.61,100.33 102.87,100.33 106.68,104.14 J6.4
TRACTIVE_SYSTEM
  Bottom 1.27: U$1.EXT3-14 43.18,105.41 55.88,92.71 102.87,92.71 104.14,91.44 J4.5
(copper drawn outside any net)
  shapes: Bottom circle x4, Top circle x4